# Altium schematic sheet SI4432_Transceiver.SchDoc
size A4; SheetNumber: 5; SheetTotal: 11
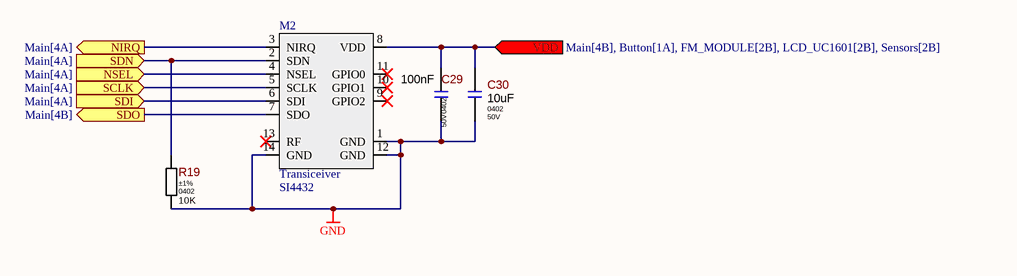
[diagram p0: SI4432_Transceiver.SchDoc]

## Parts
C29  Package: 0402  Voltage: 50V  [Cap_0402]  (hidden comment: 100nF)
C30  Package: 0402  Voltage: 50V  [Cap_0402]  (hidden comment: 10uF)
M2  Transiceiver  [SI4432]
R19  value 10K  Tolerance: ±1%  Package: 0402  [Res_0402]  (hidden comment: Res_0402_10K)

## Ports
NIRQ (out, see Main[4A]), NSEL (in, see Main[4A]), SCLK (in, see Main[4A]), SDI (in, see Main[4A]), SDN (in, see Main[4A]), SDO (out, see Main[4B]), VDD (in, see Main[4B], Button[1A], FM_MODULE[2B], LCD_UC1601[2B], Sensors[2B])

## Nets
GND: C29.2 C30.2 M2.1(GND) M2.12(GND) M2.14(GND) R19.2
NIRQ: M2.3(NIRQ) ; port NIRQ
NSEL: M2.4(NSEL) ; port NSEL
SCLK: M2.5(SCLK) ; port SCLK
SDI: M2.6(SDI) ; port SDI
SDN: M2.2(SDN) R19.1 ; port SDN
SDO: M2.7(SDO) ; port SDO
VDD: C29.1 C30.1 M2.8(VDD) ; port VDD

Not connected (* = marked no-connect by the designer): M2 9(GPIO2)* 10(GPIO1)* 11(GPIO0)* 13(RF)*

## Library data of the parts
C29 = Cap_0402_100nF: 100nF 50V  ±25% 0402 Ceramic Capacitor; Component Type: SMD; Tolerance: ±25%; ComponentLink1URL: https://search.murata.co.jp/Ceramy/image/img/A01X/G101/ENG/GRM31CR60J107ME39-01.pdf; ComponentLink1Description: Datasheet; Value: 100nF
C30 = Cap_0402_10uF: 10uF 50V  ±25% 0402 Ceramic Capacitor; Component Type: SMD; Tolerance: ±25%; ComponentLink1URL: https://search.murata.co.jp/Ceramy/image/img/A01X/G101/ENG/GRM31CR60J107ME39-01.pdf; ComponentLink1Description: Datasheet; Value: 10uF
M2 = SI4432: Name: SI4432
R19 = Res_0402_10K: ±1% 1/16W 0402; Power Rating: 0.062W; Voltage: 50V; ComponentLink1URL: https://www.yageo.com/upload/media/product/productsearch/datasheet/rchip/PYu-RC_Group_51_RoHS_L_10.pdf; ComponentLink1Description: Datasheet